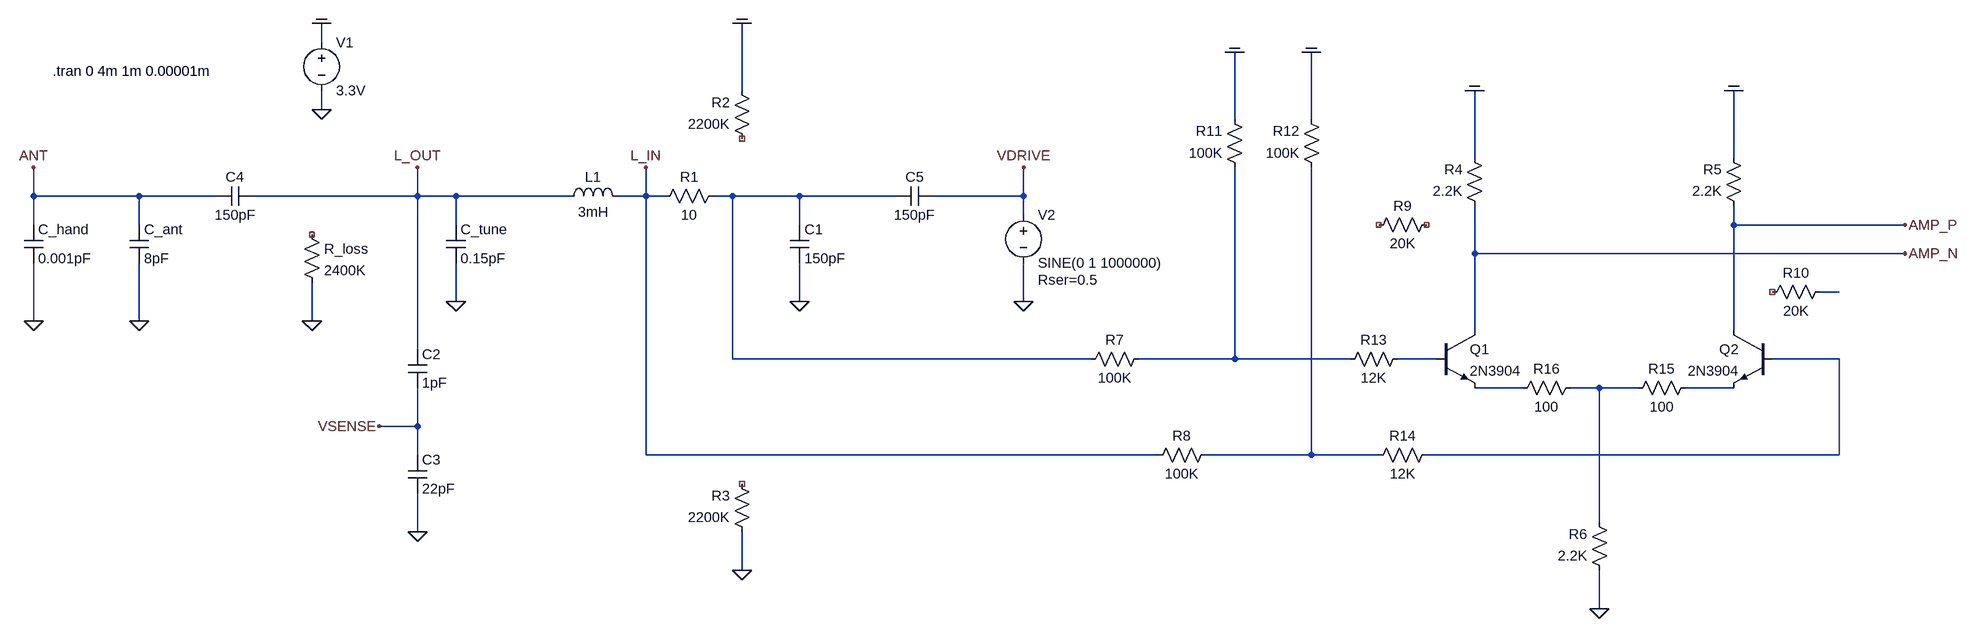
[diagram p0: schematic 2020_oscillator_experiments_v2.asc]
2020_oscillator_experiments_v2.asc, the LTspice schematic file:
Version 4
SHEET 1 2868 1044
WIRE 0 80 0 48
WIRE 736 160 736 48
WIRE 0 192 0 160
WIRE 1584 208 1584 96
WIRE 1712 208 1712 96
WIRE 1984 272 1984 160
WIRE 2416 272 2416 160
WIRE -480 336 -480 288
WIRE -304 336 -480 336
WIRE -176 336 -304 336
WIRE 160 336 160 288
WIRE 160 336 -112 336
WIRE 224 336 160 336
WIRE 448 336 224 336
WIRE 576 336 576 288
WIRE 576 336 528 336
WIRE 608 336 576 336
WIRE 720 336 688 336
WIRE 832 336 720 336
WIRE 992 336 832 336
WIRE 1232 336 1232 288
WIRE 1232 336 1056 336
WIRE 1232 368 1232 336
WIRE -480 384 -480 336
WIRE -304 384 -304 336
WIRE 224 384 224 336
WIRE 832 384 832 336
WIRE 2416 384 2416 352
WIRE 2768 384 2416 384
WIRE 1984 432 1984 352
WIRE 2768 432 1984 432
WIRE 2592 496 2560 496
WIRE 224 512 224 448
WIRE 832 512 832 448
WIRE 1232 512 1232 448
WIRE -480 544 -480 448
WIRE -304 544 -304 448
WIRE -16 544 -16 480
WIRE 1984 560 1984 432
WIRE 2416 560 2416 384
WIRE 160 592 160 336
WIRE 720 608 720 336
WIRE 1344 608 720 608
WIRE 1584 608 1584 288
WIRE 1584 608 1424 608
WIRE 1776 608 1584 608
WIRE 1920 608 1856 608
WIRE 2592 608 2480 608
WIRE 2064 656 1984 656
WIRE 2192 656 2144 656
WIRE 2256 656 2192 656
WIRE 2416 656 2336 656
WIRE 160 720 160 656
WIRE 160 720 96 720
WIRE 160 768 160 720
WIRE 576 768 576 336
WIRE 1456 768 576 768
WIRE 1712 768 1712 288
WIRE 1712 768 1536 768
WIRE 1824 768 1712 768
WIRE 2592 768 2592 608
WIRE 2592 768 1904 768
WIRE 2192 880 2192 656
WIRE 160 896 160 832
WIRE 736 960 736 896
WIRE 2192 1024 2192 960
FLAG 0 192 0
FLAG 0 48 COM
FLAG -480 288 ANT
FLAG -480 544 0
FLAG -304 544 0
FLAG 832 512 0
FLAG 160 896 0
FLAG -16 544 0
FLAG 1232 512 0
FLAG 1232 288 VDRIVE
FLAG 96 720 VSENSE
FLAG 736 960 0
FLAG 736 48 COM
FLAG 1984 160 COM
FLAG 2416 160 COM
FLAG 2192 1024 0
FLAG 576 288 L_IN
FLAG 160 288 L_OUT
FLAG 224 512 0
FLAG 2768 384 AMP_P
FLAG 2768 432 AMP_N
FLAG 1584 96 COM
FLAG 1712 96 COM
SYMBOL voltage 0 64 R0
WINDOW 123 0 0 Left 0
WINDOW 39 0 0 Left 0
SYMATTR InstName V1
SYMATTR Value 3.3V
SYMBOL ind 432 352 R270
WINDOW 0 32 56 VTop 2
WINDOW 3 5 56 VBottom 2
SYMATTR InstName L1
SYMATTR Value 3mH
SYMATTR SpiceLine Rser=120 Rpar=20Meg
SYMBOL cap 816 384 R0
SYMATTR InstName C1
SYMATTR Value 150pF
SYMBOL cap 144 592 R0
SYMATTR InstName C2
SYMATTR Value 1pF
SYMBOL cap 144 768 R0
SYMATTR InstName C3
SYMATTR Value 22pF
SYMBOL cap -320 384 R0
SYMATTR InstName C_ant
SYMATTR Value 8pF
SYMBOL cap -496 384 R0
SYMATTR InstName C_hand
SYMATTR Value 0.001pF
SYMBOL cap -112 320 R90
WINDOW 0 0 32 VBottom 2
WINDOW 3 32 32 VTop 2
SYMATTR InstName C4
SYMATTR Value 150pF
SYMBOL res -32 384 R0
SYMATTR InstName R_loss
SYMATTR Value 2400K
SYMBOL voltage 1232 352 R0
WINDOW 123 0 0 Left 0
WINDOW 39 24 124 Left 2
SYMATTR SpiceLine Rser=0.5
SYMATTR InstName V2
SYMATTR Value SINE(0 1 1000000)
SYMBOL res 704 320 R90
WINDOW 0 0 56 VBottom 2
WINDOW 3 32 56 VTop 2
SYMATTR InstName R1
SYMATTR Value 10
SYMBOL res 752 256 R180
WINDOW 0 36 76 Left 2
WINDOW 3 36 40 Left 2
SYMATTR InstName R2
SYMATTR Value 2200K
SYMBOL res 752 912 R180
WINDOW 0 36 76 Left 2
WINDOW 3 36 40 Left 2
SYMATTR InstName R3
SYMATTR Value 2200K
SYMBOL npn 1920 560 R0
SYMATTR InstName Q1
SYMATTR Value 2N3904
SYMBOL npn 2480 560 M0
SYMATTR InstName Q2
SYMATTR Value 2N3904
SYMBOL res 2000 368 R180
WINDOW 0 36 76 Left 2
WINDOW 3 36 40 Left 2
SYMATTR InstName R4
SYMATTR Value 2.2K
SYMBOL res 2432 368 R180
WINDOW 0 36 76 Left 2
WINDOW 3 36 40 Left 2
SYMATTR InstName R5
SYMATTR Value 2.2K
SYMBOL res 2208 976 R180
WINDOW 0 36 76 Left 2
WINDOW 3 36 40 Left 2
SYMATTR InstName R6
SYMATTR Value 2.2K
SYMBOL res 1440 592 R90
WINDOW 0 0 56 VBottom 2
WINDOW 3 32 56 VTop 2
SYMATTR InstName R7
SYMATTR Value 100K
SYMBOL res 1552 752 R90
WINDOW 0 0 56 VBottom 2
WINDOW 3 32 56 VTop 2
SYMATTR InstName R8
SYMATTR Value 100K
SYMBOL res 1920 368 R90
WINDOW 0 0 56 VBottom 2
WINDOW 3 32 56 VTop 2
SYMATTR InstName R9
SYMATTR Value 20K
SYMBOL res 2576 480 R90
WINDOW 0 0 56 VBottom 2
WINDOW 3 32 56 VTop 2
SYMATTR InstName R10
SYMATTR Value 20K
SYMBOL cap 1056 320 R90
WINDOW 0 0 32 VBottom 2
WINDOW 3 32 32 VTop 2
SYMATTR InstName C5
SYMATTR Value 150pF
SYMBOL cap 208 384 R0
SYMATTR InstName C_tune
SYMATTR Value 0.15pF
SYMBOL res 1600 304 R180
WINDOW 0 36 76 Left 2
WINDOW 3 36 40 Left 2
SYMATTR InstName R11
SYMATTR Value 100K
SYMBOL res 1728 304 R180
WINDOW 0 36 76 Left 2
WINDOW 3 36 40 Left 2
SYMATTR InstName R12
SYMATTR Value 100K
SYMBOL res 1872 592 R90
WINDOW 0 0 56 VBottom 2
WINDOW 3 32 56 VTop 2
SYMATTR InstName R13
SYMATTR Value 12K
SYMBOL res 1920 752 R90
WINDOW 0 0 56 VBottom 2
WINDOW 3 32 56 VTop 2
SYMATTR InstName R14
SYMATTR Value 12K
SYMBOL res 2352 640 R90
WINDOW 0 0 56 VBottom 2
WINDOW 3 32 56 VTop 2
SYMATTR InstName R15
SYMATTR Value 100
SYMBOL res 2160 640 R90
WINDOW 0 0 56 VBottom 2
WINDOW 3 32 56 VTop 2
SYMATTR InstName R16
SYMATTR Value 100
TEXT -448 128 Left 2 !.tran 0 4m 1m 0.00001m

The netlist it stands for:
* 2020_oscillator_experiments_v2.asc
V1 COM 0 3.3V
L1 L_OUT L_IN 3mH Rser=120 Rpar=20Meg
C1 N001 0 150pF
C2 L_OUT VSENSE 1pF
C3 VSENSE 0 22pF
C_ant ANT 0 8pF
C_hand ANT 0 0.001pF
C4 L_OUT ANT 150pF
R_loss NC_01 0 2400K
V2 VDRIVE 0 SINE(0 1 1000000) Rser=0.5
R1 N001 L_IN 10
R2 NC_02 COM 2200K
R3 0 NC_03 2200K
Q1 AMP_N N004 N006 0 2N3904
Q2 AMP_P N005 N008 0 2N3904
R4 AMP_N COM 2.2K
R5 AMP_P COM 2.2K
R6 0 N007 2.2K
R7 N003 N001 100K
R8 N009 L_IN 100K
R9 NC_04 NC_05 20K
R10 N002 NC_06 20K
C5 VDRIVE N001 150pF
C_tune L_OUT 0 0.15pF
R11 N003 COM 100K
R12 N009 COM 100K
R13 N004 N003 12K
R14 N005 N009 12K
R15 N008 N007 100
R16 N007 N006 100
.model NPN NPN
.model PNP PNP
.lib standard.bjt
.tran 0 4m 1m 0.00001m
.backanno
.end